# EAGLE design ir_transceiver (EAGLE 7.5.0)
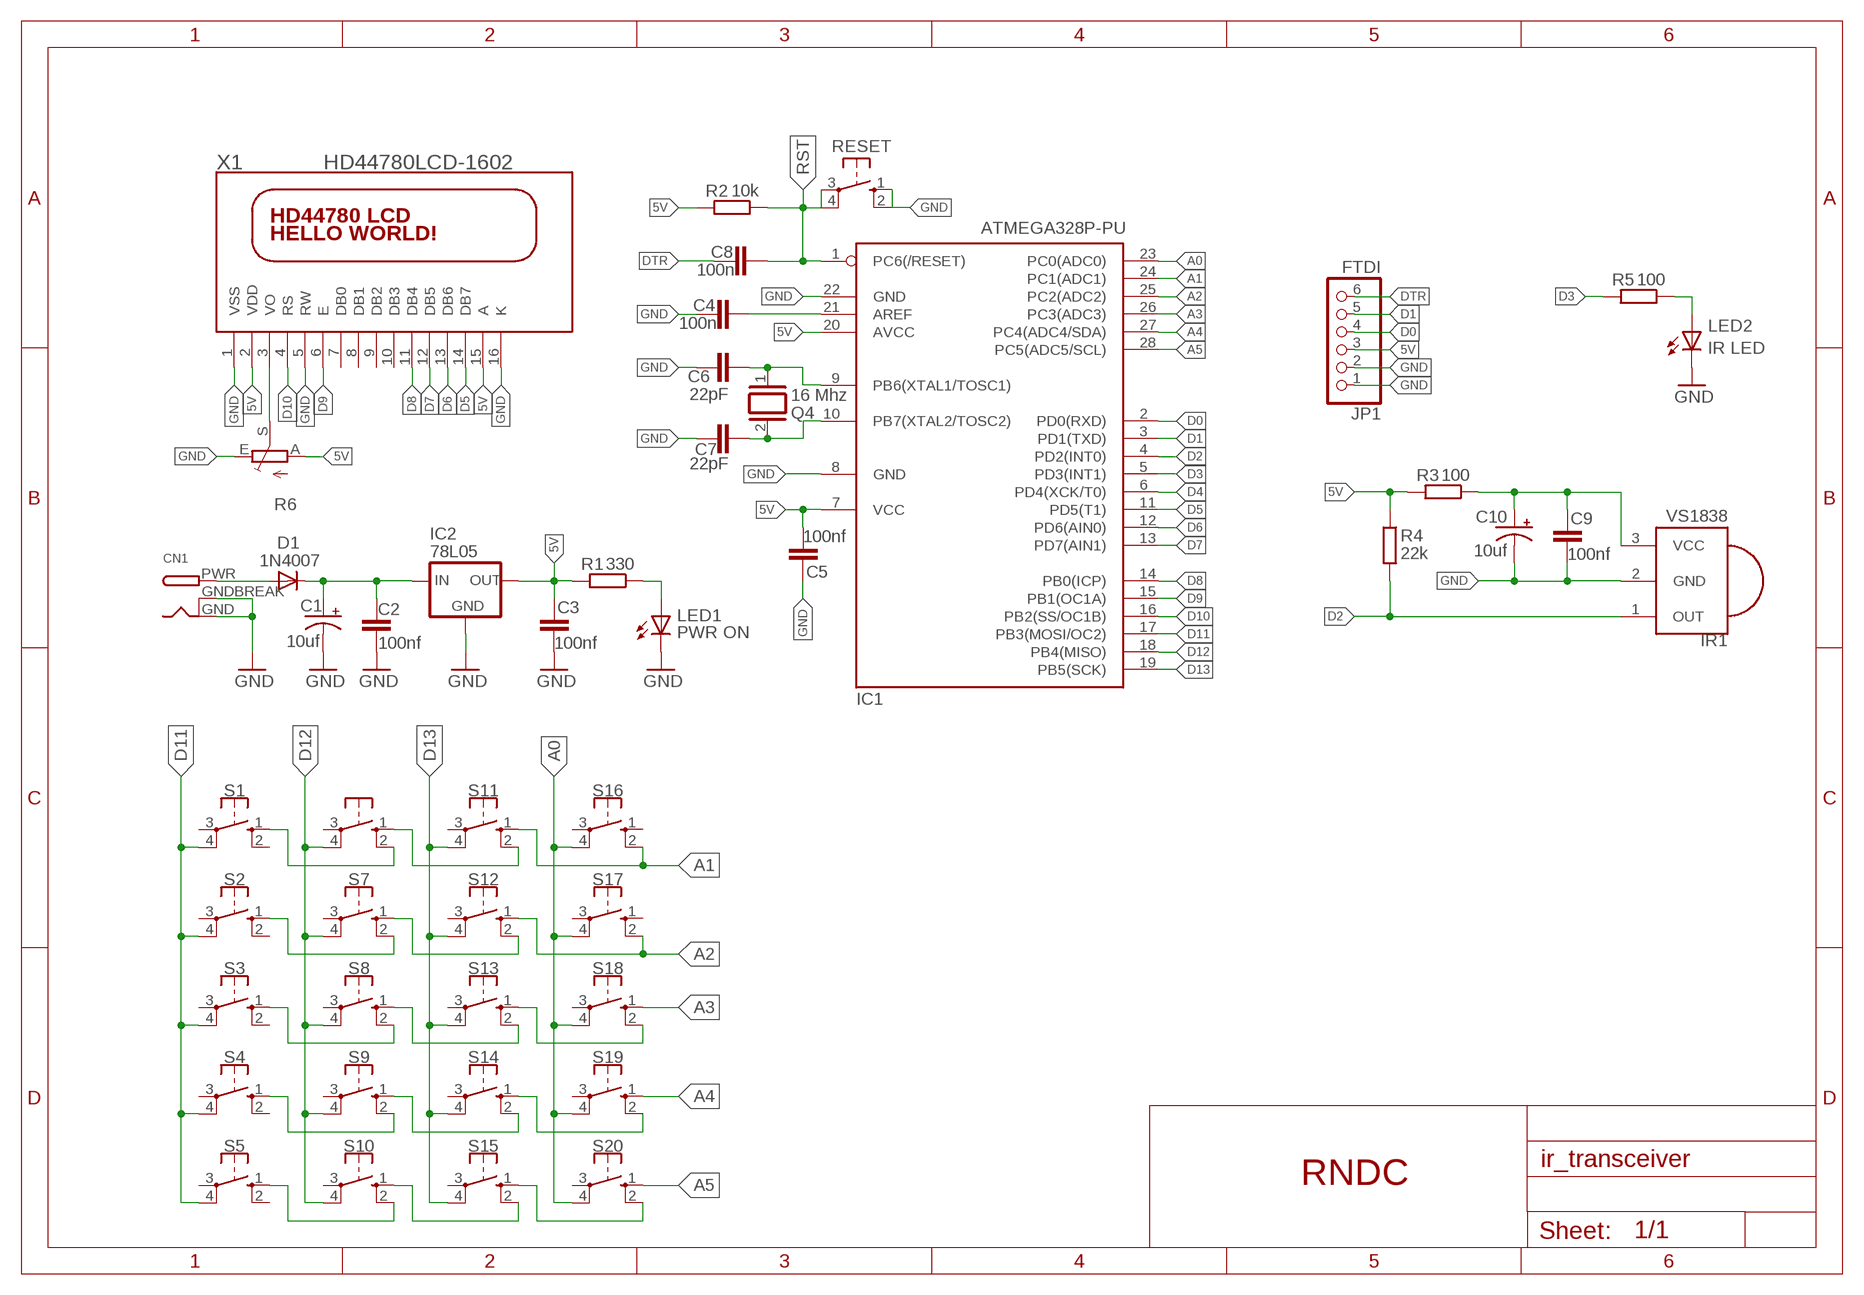
[diagram p0: schematic, sheet 1]

## Parts
C1  10uf  CPOL-USTT2D4  [TT2D4]
C2  100nf  C-EU025-024X044  [C025-024X044]
C3  100nf  C-EU025-024X044  [C025-024X044]
C4  100n  C-EU025-024X044  [C025-024X044]
C5  100nf  C-EU025-024X044  [C025-024X044]
C6  22pF  C-EU025-024X044  [C025-024X044]
C7  22pF  C-EU025-024X044  [C025-024X044]
C8  100n  C-EU025-024X044  [C025-024X044]
C9  100nf  C-EU025-024X044  [C025-024X044]
C10  10uf  CPOL-USTT2D4  [TT2D4]
CN1  DCBARRELPTH  [DCJACK_2MM_PTH]
D1  1N4007  1N4148DO35-7  [DO35-7]
IC1  ATMEGA328P-PU  [DIL28-3]
IC2  78L05  78LXX"  [78LXX]
IR1  VS1838  [VS1838]
JP1  FTDI  PINHD-1X6  [1X06]
LED1  PWR ON  LED3MM  [LED3MM]
LED2  IR LED  LED5MM  [LED5MM]
Q4  16 Mhz  XTAL/S  [QS]
R1  330  R-EU_0207_10  [0207_10]
R2  10k  R-EU_0207_10  [0207_10]
R3  100  R-EU_0207_10  [0207_10]
R4  22k  R-EU_0207_10  [0207_10]
R5  100  R-EU_0207_10  [0207_10]
R6  TRIM_EU-CA6V  [CA6V]
RESET  10-XX  [B3F-10XX]
S1  10-XX  [B3F-10XX]
S2  10-XX  [B3F-10XX]
S3  10-XX  [B3F-10XX]
S4  10-XX  [B3F-10XX]
S5  10-XX  [B3F-10XX]
S6  10-XX  [B3F-10XX]
S7  10-XX  [B3F-10XX]
S8  10-XX  [B3F-10XX]
S9  10-XX  [B3F-10XX]
S10  10-XX  [B3F-10XX]
S11  10-XX  [B3F-10XX]
S12  10-XX  [B3F-10XX]
S13  10-XX  [B3F-10XX]
S14  10-XX  [B3F-10XX]
S15  10-XX  [B3F-10XX]
S16  10-XX  [B3F-10XX]
S17  10-XX  [B3F-10XX]
S18  10-XX  [B3F-10XX]
S19  10-XX  [B3F-10XX]
S20  10-XX  [B3F-10XX]
X1  HD44780LCD-1602  [LCD1602]

## Nets
5V: C3.2 C5.2 IC1.7(VCC) IC1.20(AVCC) IC2.OUT JP1.3 R1.2 R2.2 R3.2 R4.1 R6.A X1.2(VDD) X1.15(A)
A0: IC1.23(PC0(ADC0)) S16.4(P1) S17.4(P1) S18.4(P1) S19.4(P1) S20.4(P1)
A1: IC1.24(PC1(ADC1)) S11.1(S) S16.2(S1)
A2: IC1.25(PC2(ADC2)) S12.1(S) S17.2(S1)
A3: IC1.26(PC3(ADC3)) S18.1(S)
A4: IC1.27(PC4(ADC4/SDA)) S19.1(S)
A5: IC1.28(PC5(ADC5/SCL)) S20.1(S)
D0: IC1.2(PD0(RXD)) JP1.4
D1: IC1.3(PD1(TXD)) JP1.5
D2: IC1.4(PD2(INT0)) IR1.1(OUT) R4.2
D3: IC1.5(PD3(INT1)) R5.2
D4: IC1.6(PD4(XCK/T0))
D5: IC1.11(PD5(T1)) X1.14(DB7)
D6: IC1.12(PD6(AIN0)) X1.13(DB6)
D7: IC1.13(PD7(AIN1)) X1.12(DB5)
D8: IC1.14(PB0(ICP)) X1.11(DB4)
D9: IC1.15(PB1(OC1A)) X1.6(E)
D10: IC1.16(PB2(SS/OC1B)) X1.4(RS)
D11: IC1.17(PB3(MOSI/OC2)) S1.4(P1) S2.4(P1) S3.4(P1) S4.4(P1) S5.4(P1)
D12: IC1.18(PB4(MISO)) S6.4(P1) S7.4(P1) S8.4(P1) S9.4(P1) S10.4(P1)
D13: IC1.19(PB5(SCK)) S11.4(P1) S12.4(P1) S13.4(P1) S14.4(P1) S15.4(P1)
DTR: C8.1 JP1.6
GND: C1.- C2.1 C3.1 C4.1 C5.1 C6.2 C7.2 C9.1 C10.- CN1.GND CN1.GNDBREAK IC1.8(GND) IC1.22(GND) IC2.GND IR1.2(GND) JP1.1 JP1.2 LED1.K(C) LED2.K(C) R6.E RESET.1(S) RESET.2(S1) X1.1(VSS) X1.5(RW) X1.16(K)
N$1: C9.2 C10.+ IR1.3(VCC) R3.1
N$2: LED1.A R1.1
N$3: C4.2 IC1.21(AREF)
N$4: LED2.A R5.1
N$5: R6.S X1.3(VO)
N$6: S13.1(S) S18.2(S1)
N$7: S1.1(S) S6.2(S1)
N$8: S2.1(S) S7.2(S1)
N$9: S3.1(S) S8.2(S1)
N$10: S4.1(S) S9.2(S1)
N$11: S5.1(S) S10.2(S1)
N$13: C6.1 IC1.9(PB6(XTAL1/TOSC1)) Q4.1
N$15: C7.1 IC1.10(PB7(XTAL2/TOSC2)) Q4.2
N$16: CN1.PWR D1.A
N$17: S6.1(S) S11.2(S1)
N$18: S7.1(S) S12.2(S1)
N$19: S8.1(S) S13.2(S1)
N$20: S9.1(S) S14.2(S1)
N$21: S10.1(S) S15.2(S1)
N$25: S14.1(S) S19.2(S1)
N$26: S15.1(S) S20.2(S1)
RST: C8.2 IC1.1(PC6(/RESET)) R2.1 RESET.3(P) RESET.4(P1)
VIN: C1.+ C2.2 D1.C IC2.IN
Unconnected: S1.2(S1) S1.3(P) S2.2(S1) S2.3(P) S3.2(S1) S3.3(P) S4.2(S1) S4.3(P) S5.2(S1) S5.3(P) S6.3(P) S7.3(P) S8.3(P) S9.3(P) S10.3(P) S11.3(P) S12.3(P) S13.3(P) S14.3(P) S15.3(P) S16.1(S) S16.3(P) S17.1(S) S17.3(P) S18.3(P) S19.3(P) S20.3(P) X1.7(DB0) X1.8(DB1) X1.9(DB2) X1.10(DB3)

## Notes on the sheet
- RNDC

## Library data of the parts
C1 C10 = rcl:CPOL-US: POLARIZED CAPACITOR, American symbol
C2-C5 C8 C9 = Bona:C-EU: CAPACITOR, European symbol
C6 C7 = rcl:C-EU: CAPACITOR, European symbol
CN1 = Bona:DCBARREL: 2.0mm DC Barrel Jack DCJACK_2MM_PTH - Through Hole Jack (4UConnector: 05537)
D1 = Bona:1N4148: DIODE Small Signal Fast Switching Diodes
IC1 = Itead_IC_110429:ATMEGA328P-PU: ICC002
IC2 = Bona:78LXX: VOLTAGE REGULATOR
IR1 = Bona:VS1838: IR 38KHz receiver VS1838 and related receivers
JP1 = Bona:PINHD-1X6: PIN HEADER
LED1 LED2 = adafruit:LED: LED OSRAM: - CHIPLED LG R971, LG N971, LY N971, LG Q971, LY Q971, LO R971, LY R971 LH N974, LH R974 LS Q976, LO Q976, LY Q976 LO Q996 - Hyper CHIPLED LW Q18S LB Q993, LB Q99A, LB R99A - SideLED LS A670, LO A670, LY A670, LG A670, LP A670 LB A673, LV A673, LT A673, LW A673 LH A674 LY A675 LS A676, LA A676, LO A676, LY A676, LW A676 LS A679, LY A679, LG A679 - Hyper Micro SIDELED® LS Y876, LA Y876, LO Y876, LY Y876 LT Y87S - SmartLED LW L88C, LW L88S LB L89C, LB L89S, LG L890 LS L89K, LO L89K, LY L89K LS L896, LA L896, LO L896, LY L896 - TOPLED LS T670, LO T670, LY T670, LG T670, LP T670 LSG T670, LSP T670, LSY T670, LOP T670, LYG T670 LG T671, LOG T671, LSG T671 LB T673, LV T673, LT T673, LW T673 LH T674 LS T676, LA T676, LO T676, LY T676, LB T676, LH T676, LSB T676, LW T676 LB T67C, LV T67C, LT T67C, LS T67K, LO T67K, LY T67K, LW E67C LS E67B, LA E67B, LO E67B, LY E67B, LB E67C, LV E67C, LT E67C LW T67C LS T679, LY T679, LG T679 LS T770, LO T770, LY T770, LG T770, LP T770 LB T773, LV T773, LT T773, LW T773 LH T774 LS E675, LA E675, LY E675, LS T675 LS T776, LA T776, LO T776, LY T776, LB T776 LHGB T686 LT T68C, LB T68C - Hyper Mini TOPLED® LB M676 - Mini TOPLED Santana® LG M470 LS M47K, LO M47K, LY M47K Source: http://www.osram.convergy.de/
Q4 = special:XTAL/S: CRYSTAL
R1-R5 = Bona:R-EU_: RESISTOR, European symbol
R6 = pot:TRIM_EU-: POTENTIOMETER
RESET S1-S20 = switch-omron:10-XX: OMRON SWITCH; MPN: B3F-1000; OC_FARNELL: 176432; OC_NEWARK: 36M3542
X1 = Bona:HD44780LCD: HD44780 LCD Standard character type LCDs, available in sizes from 8x1 to 40x4!

## Board
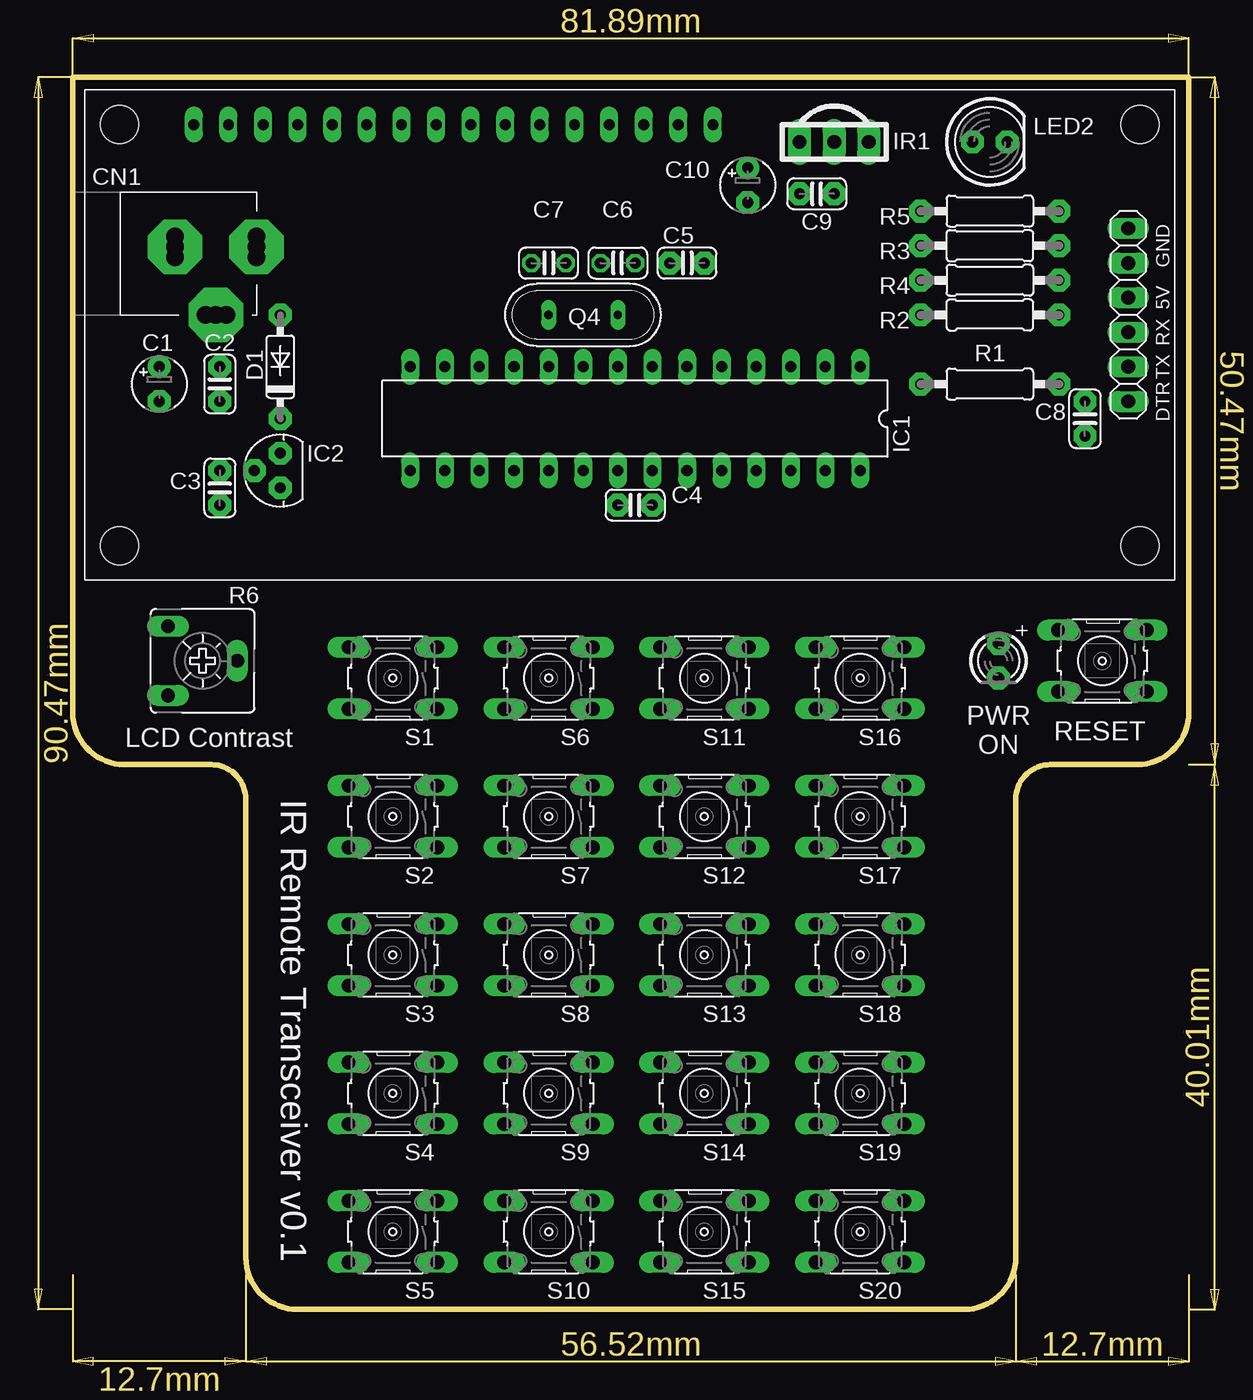
[diagram p1: board, top side]
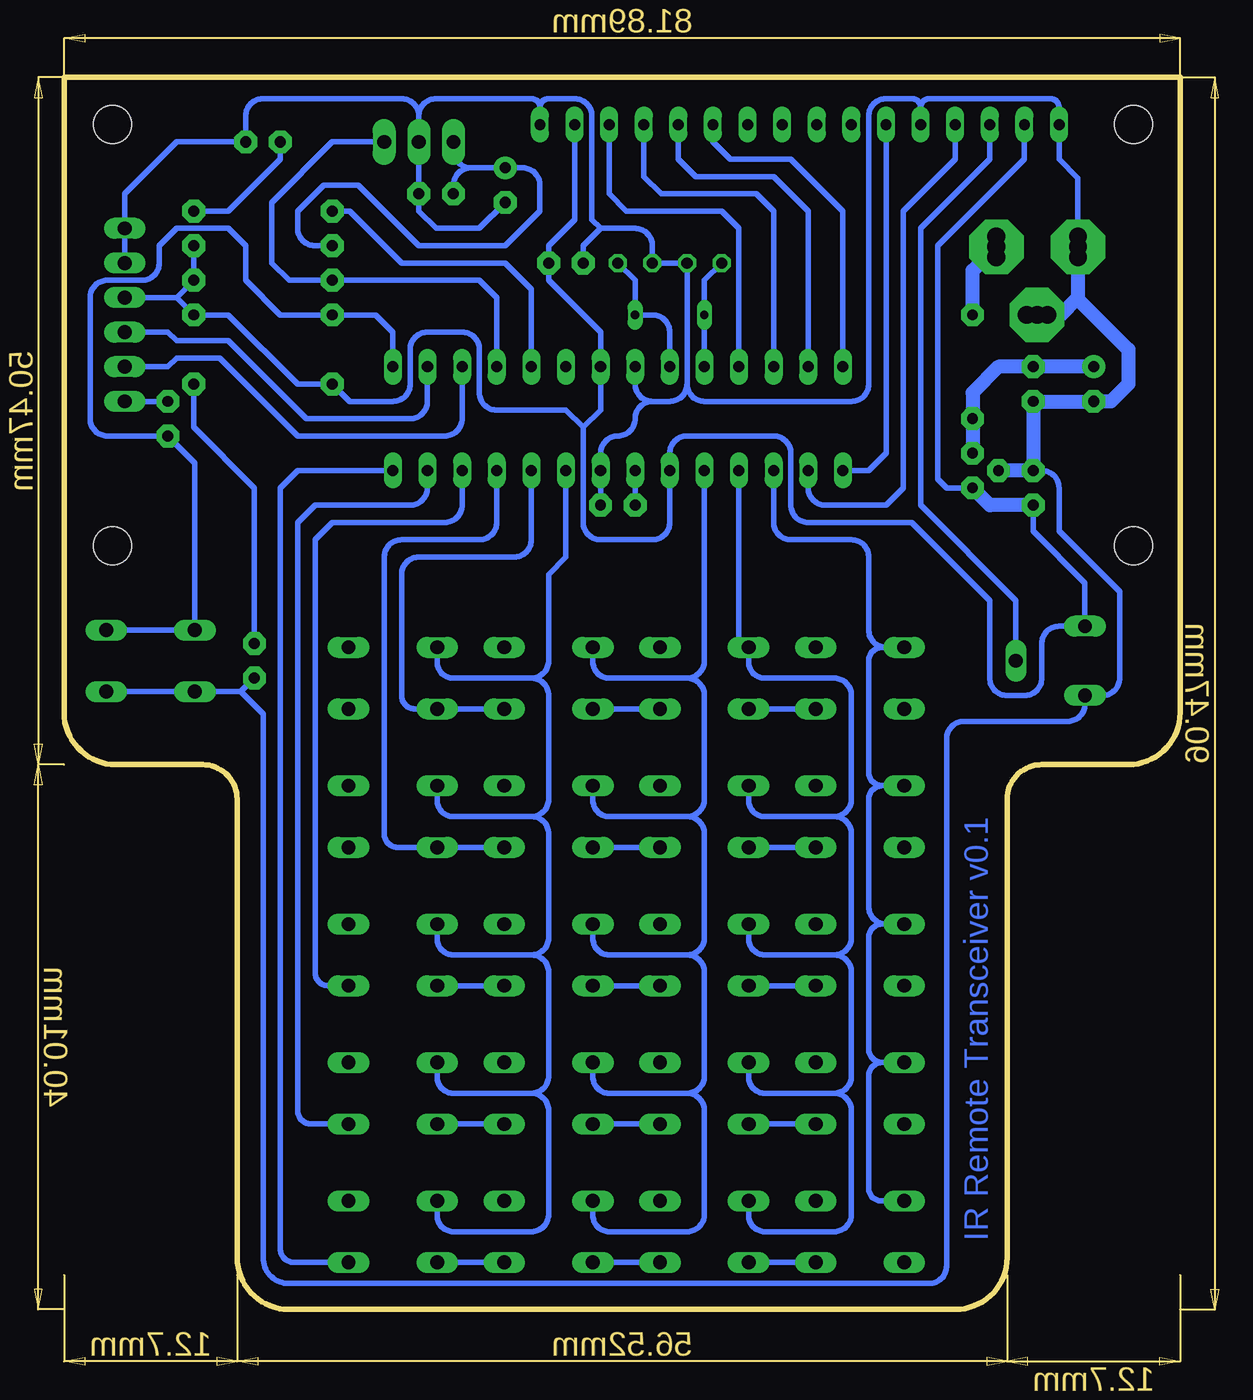
[diagram p2: board, bottom side, seen from below]

Size 81.92 x 90.47 mm. Coordinates in mm from the lower left corner, seen from the top.
Outline: 81.89,43.81 81.89,90.47 0,90.47 0,43.81 arc90 3.81,40.01 10.16,40.01 arc-90 12.7,37.47 12.7,3.81 arc90 16.51,0 65.41,0 arc90 69.22,3.81 69.22,37.47 arc-90 71.75,40.01 78.11,40.01 arc90 81.92,43.81
Copper layers (1*16): Top 0.035mm / dielectric 1.5mm / Bottom 0.035mm
Design rules "default": minimum track width 10mil, minimum drill 24mil, track to track 8mil, track to pad 8mil, pad to pad 8mil, via to via 8mil, smd to smd 8mil, copper to edge 40mil, drill to drill 8mil, minimum pad ring 10mil, minimum via ring 8mil, stop-mask expansion 4mil, vias tented up to drill 0mil, thermal gap 10mil

### Footprints (pad centres in the part's own frame; a part is rotated, then mirrored left to right if it is on the bottom)
TT2D4 = drill 0.813 pad 1.676: + -1.27,0 | drill 0.813 pad 1.676 octagon: - 1.27,0
C025-024X044 = drill 0.8 pad 1.676 octagon: 1 -1.27,0; 2 1.27,0
C025-024X044' = drill 0.813 octagon: 1 -1.27,0; 2 1.27,0
DCJACK_2MM_PTH = drill 1.3: 4 4.445,11.259; 5 4.445,9.735; 6 0.203,7.499; 7 -1.321,7.499; 8 0.203,13.494; 9 -1.321,13.494 | drill 1.3 pad 4 octagon: GND -0.559,7.499; GNDBREAK 4.445,10.497; PWR -0.559,13.494
DO35-7 = drill 0.8 pad 1.676 octagon: A 3.81,0; C -3.81,0
DIL28-3 = drill 0.813 long: 1 -16.51,-3.81; 2 -13.97,-3.81; 3 -11.43,-3.81; 4 -8.89,-3.81; 5 -6.35,-3.81; 6 -3.81,-3.81; 7 -1.27,-3.81; 8 1.27,-3.81; 9 3.81,-3.81; 10 6.35,-3.81; 11 8.89,-3.81; 12 11.43,-3.81; 13 13.97,-3.81; 14 16.51,-3.81; 15 16.51,3.81; 16 13.97,3.81; 17 11.43,3.81; 18 8.89,3.81; 19 6.35,3.81; 20 3.81,3.81; 21 1.27,3.81; 22 -1.27,3.81; 23 -3.81,3.81; 24 -6.35,3.81; 25 -8.89,3.81; 26 -11.43,3.81; 27 -13.97,3.81; 28 -16.51,3.81
78LXX = drill 0.8 pad 1.676 octagon: GND 0,1.905; IN 1.27,0; OUT -1.27,0
VS1838 = drill 1.016 pad 1.676 long: 1 -2.54,0; 2 0,0; 3 2.54,0
1X06 = drill 1.016 long: 1 -6.35,0; 2 -3.81,0; 3 -1.27,0; 4 1.27,0; 5 3.81,0; 6 6.35,0
LED3MM = drill 0.813 pad 1.676 octagon: A -1.27,0; K 1.27,0
LED5MM = drill 0.813 pad 1.676 octagon: A -1.27,0; K 1.27,0
QS = drill 0.61 long: 1 -2.54,0; 2 2.54,0
0207_10 = drill 0.8 pad 1.676 octagon: 1 -5.08,0; 2 5.08,0
CA6V = drill 1.016 long: A -2.54,-2.54; E 2.54,-2.54; S 0,2.54
B3F-10XX = drill 1.016 long: 1 -3.251,2.261; 2 3.251,2.261; 3 -3.251,-2.261; 4 3.251,-2.261
LCD1602 = drill 0.8 long: 1 7.619,33.028; 2 10.159,33.028; 3 12.699,33.028; 4 15.239,33.028; 5 17.779,33.028; 6 20.319,33.028; 7 22.859,33.028; 8 25.399,33.028; 9 27.939,33.028; 10 30.479,33.028; 11 33.019,33.028; 12 35.559,33.028; 13 38.099,33.028; 14 40.639,33.028; 15 43.179,33.028; 16 45.719,33.028 | hole 2.8: 2.159,2.108; 2.159,33.028; 77.079,33.028; 77.079,2.108

### Placement (x,y rotation side)
C1  6.35,67.94 270 top
C2  10.79,67.94 90 top
C3  10.79,60.33 270 top
C4  41.27,59.05 180 top
C5  45.09,76.83 0 top
C6  22pF  [C025-024X044']  40.01,76.83 180 top
C7  22pF  [C025-024X044']  34.92,76.83 0 top
C8  74.3,65.41 270 top
C9  54.61,81.92 180 top
C10  49.53,82.55 270 top
CN1  0,77.47 270 top
D1  15.24,69.22 90 top
IC1  41.27,65.41 180 top
IC2  15.24,61.59 90 top
IR1  55.88,85.72 180 top
JP1  77.47,73.03 270 top
LED1  67.94,47.62 270 top
LED2  67.31,85.72 0 top
Q4  37.47,73.03 180 top
R1  67.31,67.94 180 top
R2  67.31,73.03 0 top
R3  67.31,78.11 0 top
R4  67.31,75.56 180 top
R5  67.31,80.64 180 top
R6  9.53,47.62 270 top
RESET  75.56,47.62 180 top
S1  23.5,46.35 180 top
S2  23.5,36.2 180 top
S3  23.5,26.04 180 top
S4  23.5,15.88 180 top
S5  23.5,5.71 180 top
S6  34.92,46.35 180 top
S7  34.92,36.2 180 top
S8  34.92,26.04 180 top
S9  34.92,15.88 180 top
S10  34.92,5.71 180 top
S11  46.35,46.35 180 top
S12  46.35,36.2 180 top
S13  46.35,26.04 180 top
S14  46.35,15.88 180 top
S15  46.35,5.71 180 top
S16  57.78,46.35 180 top
S17  57.78,36.2 180 top
S18  57.78,26.04 180 top
S19  57.78,15.88 180 top
S20  57.78,5.71 180 top
X1  1.27,53.98 0 top

### Tracks (layer width: path | path; a pad name or v marks a point on that pad's centre or on a via)
5V
  Bottom 0.406: IC2.OUT 17.14,60.33 17.78,60.96 17.78,78.11 11.43,84.45 X1.2 | C3.2 10.79,57.15 6.99,53.34 R6.A 8.89,50.16 arc-90 10.16,48.9 10.16,46.35 arc90 11.43,45.09 12.7,45.09 arc90 13.97,46.35 13.97,52.07 19.68,57.78 27.3,57.78 arc90 28.57,59.05 28.57,62.87 arc-90 29.84,64.14 36.2,64.14 arc-90 37.47,62.87 IC1.20 37.47,57.78 arc90 38.73,56.52 42.55,56.52 arc90 43.81,57.78 43.81,64.77 | 43.81,64.77 42.55,66.04 IC1.7 42.55,71.75 46.35,75.56 C5.2 46.35,78.11 44.45,80.01 X1.15 | R3.2 R4.1 73.66,74.3 | 43.81,64.77 45.09,66.04 50.16,66.04 arc90 51.44,67.31 51.44,70.48 arc-90 52.7,71.75 55.24,71.75 arc-90 56.52,70.48 56.52,67.94 arc90 57.78,66.67 60.96,66.67 R1.2 64.77,67.94 69.85,73.03 R2.2 73.66,74.3 | JP1.3 73.66,74.3
  Bottom 1.016: C3.2 13.97,59.05 IC2.OUT
A0
  Bottom 0.406: S20.4 54.53,6.91 arc-90 53.34,5.71 47.62,5.71 arc-90 46.35,6.99 46.35,14.61 arc-90 47.62,15.88 | 47.62,15.88 arc-90 46.35,17.14 46.35,24.77 arc-90 47.62,26.04 | 47.62,26.04 arc-90 46.35,27.3 46.35,34.92 arc-90 47.62,36.2 | 47.62,36.2 arc-90 46.35,37.47 46.35,45.09 arc-90 47.62,46.35 | 47.62,46.35 arc-90 46.35,47.62 46.35,53.98 45.09,55.24 IC1.23 | S19.4 54.53,17.07 arc-90 53.34,15.88 47.62,15.88 | S18.4 54.53,27.23 arc-90 53.34,26.04 47.62,26.04 | S17.4 54.53,37.39 arc-90 53.34,36.2 47.62,36.2 | S16.4 54.53,47.55 arc-90 53.34,46.35 47.62,46.35
A1
  Bottom 0.406: S11.1 S16.2 56.16,44.09 arc90 57.15,45.09 57.15,53.98 arc90 55.88,55.24 48.9,55.24 arc-90 47.62,56.52 IC1.24
A2
  Bottom 0.406: S12.1 S17.2 57.43,33.93 arc90 58.42,34.92 58.42,55.24 arc90 57.15,56.52 51.44,56.52 arc-90 50.16,57.78 IC1.25
A3
  Bottom 0.406: S18.1 62.51,23.77 arc90 63.5,24.77 63.5,56.52 62.23,57.78 53.98,57.78 arc-90 52.7,59.05 IC1.26
A4
  Bottom 0.406: S19.1 63.78,13.61 arc90 64.77,14.61 64.77,57.78 63.5,59.05 56.52,59.05 arc-90 55.24,60.33 IC1.27
A5
  Bottom 0.406: S20.1 65.05,3.45 arc90 66.04,4.45 66.04,60.33 64.77,61.59 IC1.28
D0
  Bottom 0.406: IC1.2 55.24,66.67 arc90 56.52,65.41 64.14,65.41 69.85,71.12 73.66,71.12 74.3,71.75 JP1.4
D1
  Bottom 0.406: IC1.3 52.7,65.41 arc90 53.98,64.14 64.77,64.14 70.48,69.85 73.66,69.85 74.3,69.22 JP1.5
D2
  Bottom 0.406: IR1.1 62.23,85.72 66.67,81.28 66.67,76.83 65.41,75.56 R4.2 51.44,75.56 50.16,74.3 IC1.4
D3
  Bottom 0.406: R5.2 60.96,80.64 57.15,76.83 49.53,76.83 47.62,74.93 IC1.5
D5
  Bottom 0.406: IC1.11 32.38,79.38 33.66,80.64 40.64,80.64 41.91,81.92 X1.14 arc90 X1.14
D6
  Bottom 0.406: IC1.12 29.84,80.64 31.11,81.92 38.1,81.92 39.37,83.19 39.37,85.72 39.37,85.73 X1.13
D7
  Bottom 0.406: IC1.13 27.3,80.64 29.84,83.19 35.56,83.19 36.83,84.45 X1.12 arc90 X1.12
D8
  Bottom 0.406: IC1.14 24.77,80.64 28.57,84.45 33.02,84.45 34.29,85.72 X1.11 arc90 X1.11
D9
  Bottom 0.406: X1.6 21.59,81.91 21.59,81.28 21.59,62.87 22.86,61.59 IC1.15
D10
  Bottom 0.406: X1.4 16.51,84.46 20.32,80.64 20.32,60.33 21.59,59.05 26.04,59.05 arc90 27.3,60.33 IC1.16
D11
  Bottom 0.406: S1.4 21.59,48.62 | 21.59,48.62 21.87,48.62 arc-90 22.86,47.62 22.86,39.45 arc-90 21.87,38.46 | IC1.17 29.84,57.78 arc-90 28.57,56.52 24.13,56.52 arc90 22.86,55.24 22.86,49.89 arc-90 21.59,48.62 | S3.4 21.59,28.3 | 21.59,28.3 21.87,28.3 arc-90 22.86,27.3 22.86,19.13 arc-90 21.87,18.14 | S2.4 21.87,38.46 | 21.87,38.46 arc-90 22.86,37.47 22.86,29.57 arc-90 21.59,28.3 | S5.4 21.95,7.98 arc90 22.86,8.89 22.86,17.14 arc90 21.87,18.14 | S4.4 21.87,18.14
D12
  Bottom 0.406: S10.4 31.67,6.91 arc-90 30.48,5.71 25.4,5.71 arc-90 24.13,6.99 24.13,14.61 arc-90 25.4,15.88 | 25.4,15.88 arc-90 24.13,17.14 24.13,24.77 arc-90 25.4,26.04 | 25.4,26.04 arc-90 24.13,27.3 24.13,34.92 arc-90 25.4,36.2 | 25.4,36.2 arc-90 24.13,37.47 24.13,45.09 arc-90 25.4,46.35 30.48,46.35 arc90 31.67,47.55 S6.4 32.38,48.62 IC1.18 | S7.4 31.67,37.39 arc-90 30.48,36.2 25.4,36.2 | S8.4 31.67,27.23 arc-90 30.48,26.04 25.4,26.04 | S9.4 31.67,17.07 arc-90 30.48,15.88 25.4,15.88
D13
  Bottom 0.406: S15.4 43.1,6.91 arc-90 41.91,5.71 36.2,5.71 arc-90 34.92,6.99 34.92,14.61 arc-90 36.2,15.88 | 36.2,15.88 arc-90 34.92,17.14 34.92,24.77 arc-90 36.2,26.04 | 36.2,26.04 arc-90 34.92,27.3 34.92,34.92 arc-90 36.2,36.2 | 36.2,36.2 arc-90 34.92,37.47 34.92,45.09 arc-90 36.2,46.35 | 36.2,46.35 arc-90 34.92,47.62 IC1.19 | S14.4 43.1,17.07 arc-90 41.91,15.88 36.2,15.88 | S13.4 43.1,27.23 arc-90 41.91,26.04 36.2,26.04 | S12.4 43.1,37.39 arc-90 41.91,36.2 36.2,36.2 | S11.4 43.1,47.55 arc-90 41.91,46.35 36.2,46.35
DTR
  Bottom 0.406: C8.1 JP1.6
GND
  Bottom 0.406: CN1.GND 7.5,83.06 8.89,84.45 X1.1 8.89,88.26 arc-90 9.53,88.9 18.41,88.9 arc-90 19.05,88.27 | C3.1 10.16,61.59 arc90 8.89,60.33 8.89,57.15 4.45,52.7 4.45,46.35 arc90 5.71,45.09 R6.E 6.99,44.45 arc90 8.26,43.18 15.88,43.18 arc-90 17.14,41.91 17.14,3.17 arc90 18.41,1.91 65.41,1.91 arc90 67.31,3.81 67.31,43.74 68.94,45.36 | X1.5 arc-90 X1.5 arc90 X1.5 | 19.05,88.27 arc-90 19.68,88.9 21.59,88.9 arc-90 22.86,87.63 22.86,67.94 arc90 24.13,66.67 34.92,66.67 arc90 36.2,67.94 | 36.2,67.94 C7.2 C6.2 38.73,78.11 arc-90 40.01,79.38 42.55,79.38 | IC1.8 40.01,67.94 arc-90 38.73,66.67 | 38.73,66.67 37.47,66.67 arc-90 36.2,67.94 | X1.16 46.99,88.27 | 46.99,88.27 arc90 46.35,88.9 44.45,88.9 arc90 43.18,87.63 43.18,80.01 42.55,79.38 | C4.1 IC1.22 42.55,62.87 arc90 41.27,64.14 arc-90 40.01,65.41 arc90 38.73,66.67 | 19.05,88.27 X1.5 | 55.88,87.63 IR1.2 C9.1 55.88,80.64 54.61,79.38 51.44,79.38 C10.- | 55.88,87.63 arc90 54.61,88.9 47.62,88.9 arc90 46.99,88.27 | 55.88,87.63 arc-90 57.15,88.9 67.31,88.9 arc-90 68.58,87.63 LED2.K 73.66,85.72 77.47,81.92 JP1.1 JP1.2 | C5.1 43.81,78.11 42.55,79.38 | RESET.1 RESET.2 68.94,45.36 | 68.94,45.36 LED1.K
  Bottom 1.016: CN1.GND 7.5,74.3 | 7.5,74.3 7.5,74.17 3.81,70.48 3.81,67.94 5.08,66.67 C1.- C2.1 C3.1 IC2.GND | CN1.GNDBREAK 8.77,73.03 7.5,74.3
N$1
  Bottom 0.406: R3.1 63.5,78.11 arc90 64.77,79.38 64.77,80.64 62.87,82.55 60.33,82.55 55.88,78.11 49.53,78.11 46.99,80.64 46.99,82.55 arc-90 48.26,83.82 C10.+ 52.07,83.82 | IR1.3 53.34,85.09 arc-90 52.07,83.82 | C9.2 53.34,82.55 arc90 52.07,83.82
N$2
  Bottom 0.406: LED1.A 67.94,60.33 72.39,64.77 R1.1
N$3
  Bottom 0.406: IC1.21 C4.2
N$4
  Bottom 0.406: LED2.A 66.04,84.45 69.85,80.64 R5.1
N$5
  Bottom 0.406: X1.3 13.97,84.46 19.05,79.38 19.05,59.05 12.06,52.07 R6.S
N$6
  Bottom 0.406: S13.1 S18.2
N$7
  Bottom 0.406: S1.1 S6.2
N$8
  Bottom 0.406: S2.1 S7.2
N$9
  Bottom 0.406: S3.1 S8.2
N$10
  Bottom 0.406: S4.1 S9.2
N$11
  Bottom 0.406: S5.1 S10.2
N$13
  Bottom 0.406: IC1.9 37.47,71.75 arc-90 38.73,73.03 Q4.1 40.01,75.56 C6.1
N$15
  Bottom 0.406: IC1.10 Q4.2 34.92,75.56 C7.1
N$16
  Bottom 1.016: D1.A 15.24,76.28 CN1.PWR
N$17
  Bottom 0.406: S6.1 S11.2
N$18
  Bottom 0.406: S7.1 S12.2
N$19
  Bottom 0.406: S8.1 S13.2
N$20
  Bottom 0.406: S14.2 S9.1
N$21
  Bottom 0.406: S10.1 S15.2
N$25
  Bottom 0.406: S14.1 S19.2
N$26
  Bottom 0.406: S15.1 S20.2
RST
  Bottom 0.406: IC1.1 57.78,71.75 59.05,73.03 R2.1 66.04,73.03 68.58,75.56 68.58,78.11 69.85,79.38 73.66,79.38 74.93,78.11 74.93,76.83 arc90 76.2,75.56 78.74,75.56 arc-90 80.01,74.3 80.01,65.41 arc-90 78.74,64.14 C8.2 72.31,62.15 RESET.4 RESET.3
VIN
  Bottom 1.016: C1.+ C2.2 13.34,69.22 15.24,67.31 D1.C IC2.IN

### Text on the board
Bottom: IR Remote Transceiver v0.1
tNames: GND | 5V | RX | TX | DTR | PWR / ON | RESET | LCD Contrast | IR Remote Transceiver v0.1